# Altium schematic sheet Center Console - IO Expander.SchDoc: Center Console IO Expander
size Letter; Organization: Midnight Sun Solar Rayce Car Team; Address1: University of Waterloo; Address2: 200 University Ave W; Address3: Waterloo, ON, Canada; Address4: N2L 3E9; SheetNumber: 1; SheetTotal: 2; Website: www.uwmidsun.com
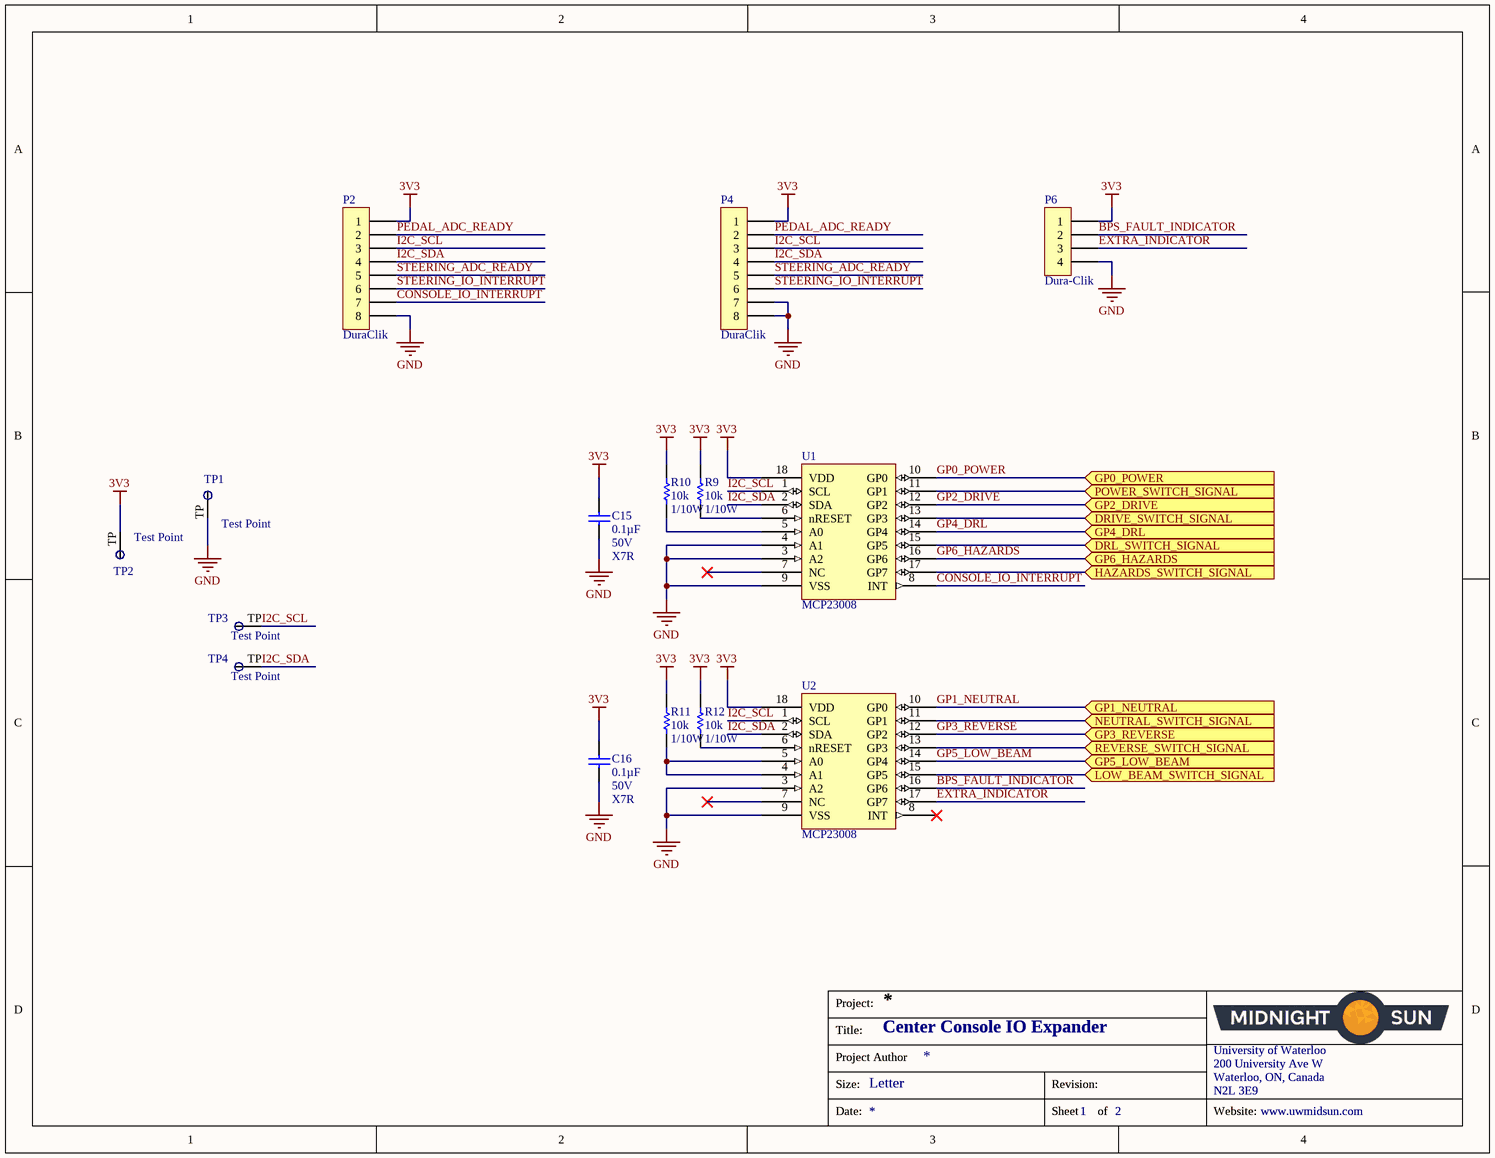
[diagram p0: Center Console - IO Expander.SchDoc]

## Parts
C15  Capacitance: 0.1µF  Voltage: 50V  Temperature Coefficient: X7R  [CAP, 0603]  (hidden comment: CAP CER 0.1UF 50V 10% X7R 0603)
C16  Capacitance: 0.1µF  Voltage: 50V  Temperature Coefficient: X7R  [CAP, 0603]  (hidden comment: CAP CER 0.1UF 50V 10% X7R 0603)
P2  Series: DuraClik  [CONN, 8POS Dura-Clik]  (hidden comment: CONN 8POS DURA-CLIK 0.079")
P4  Series: DuraClik  [CONN, 8POS Dura-Clik]  (hidden comment: CONN 8POS DURA-CLIK 0.079")
P6  Dura-Clik  [CONN, 4POS DURA-CLIK VERT]
R9  Resistance: 10k  Power: 1/10W  [RES, 0603]  (hidden comment: RES 10K OHM 1% 1/10W 0603)
R10  Resistance: 10k  Power: 1/10W  [RES, 0603]  (hidden comment: RES 10K OHM 1% 1/10W 0603)
R11  Resistance: 10k  Power: 1/10W  [RES, 0603]  (hidden comment: RES 10K OHM 1% 1/10W 0603)
R12  Resistance: 10k  Power: 1/10W  [RES, 0603]  (hidden comment: RES 10K OHM 1% 1/10W 0603)
TP1  Test Point  [Test Point]  (no BOM)
TP2  Test Point  [Test Point]  (no BOM)
TP3  Test Point  [Test Point]  (no BOM)
TP4  Test Point  [Test Point]  (no BOM)
U1  MCP23008  [IC 18SOIC]
U2  MCP23008  [IC 18SOIC]

## Ports
DRIVE_SWITCH_SIGNAL (in), DRL_SWITCH_SIGNAL (in), GP0_POWER (in), GP1_NEUTRAL (in), GP2_DRIVE (in), GP3_REVERSE (in), GP4_DRL (in), GP5_LOW_BEAM (in), GP6_HAZARDS (in), HAZARDS_SWITCH_SIGNAL (in), LOW_BEAM_SWITCH_SIGNAL (in), NEUTRAL_SWITCH_SIGNAL (in), POWER_SWITCH_SIGNAL (in), REVERSE_SWITCH_SIGNAL (in)

## Nets
3V3: C15.1 C16.1 P2.1 P4.1 P6.1 R9.1 R10.1 R11.1 R12.1 TP2.TP U1.18(VDD) U2.18(VDD)
GND: C15.2 C16.2 P2.8 P4.7 P4.8 P6.4 TP1.TP U1.3(A2) U1.4(A1) U1.9(VSS) U2.3(A2) U2.9(VSS)
BPS_FAULT_INDICATOR: P6.2 U2.16(GP6)
CONSOLE_IO_INTERRUPT: P2.7 U1.8(INT)
DRIVE_SWITCH_SIGNAL: U1.13(GP3) ; port DRIVE_SWITCH_SIGNAL
DRL_SWITCH_SIGNAL: U1.15(GP5) ; port DRL_SWITCH_SIGNAL
EXTRA_INDICATOR: P6.3 U2.17(GP7)
GP0_POWER: U1.10(GP0) ; port GP0_POWER
GP1_NEUTRAL: U2.10(GP0) ; port GP1_NEUTRAL
GP2_DRIVE: U1.12(GP2) ; port GP2_DRIVE
GP3_REVERSE: U2.12(GP2) ; port GP3_REVERSE
GP4_DRL: U1.14(GP4) ; port GP4_DRL
GP5_LOW_BEAM: U2.14(GP4) ; port GP5_LOW_BEAM
GP6_HAZARDS: U1.16(GP6) ; port GP6_HAZARDS
HAZARDS_SWITCH_SIGNAL: U1.17(GP7) ; port HAZARDS_SWITCH_SIGNAL
I2C_SCL: P2.3 P4.3 TP3.TP U1.1(SCL) U2.1(SCL)
I2C_SDA: P2.4 P4.4 TP4.TP U1.2(SDA) U2.2(SDA)
LOW_BEAM_SWITCH_SIGNAL: U2.15(GP5) ; port LOW_BEAM_SWITCH_SIGNAL
NEUTRAL_SWITCH_SIGNAL: U2.11(GP1) ; port NEUTRAL_SWITCH_SIGNAL
PEDAL_ADC_READY: P2.2 P4.2
POWER_SWITCH_SIGNAL: U1.11(GP1) ; port POWER_SWITCH_SIGNAL
REVERSE_SWITCH_SIGNAL: U2.13(GP3) ; port REVERSE_SWITCH_SIGNAL
STEERING_ADC_READY: P2.5 P4.5
STEERING_IO_INTERRUPT: P2.6 P4.6
NetR9_2: R9.2 U1.6(nRESET)
NetR10_2: R10.2 U1.5(A0)
NetR11_2: R11.2 U2.4(A1) U2.5(A0)
NetR12_2: R12.2 U2.6(nRESET)

Not connected (* = marked no-connect by the designer): U1 7(NC)*; U2 7(NC)* 8(INT)*

## Notes on the sheet
- Project:
- Title:
- Size:
- Project Author
- Letter
- Revision:
- University of Waterloo
- 200 University Ave W
- Waterloo, ON, Canada
- N2L 3E9
- Date:
- Sheet
- of
- Website:

## Library data of the parts
C15 C16 = CAP CER 0.1UF 50V 10% X7R 0603: 0.10µF ±10% 50V Ceramic Capacitor X7R 0603 (1608 Metric); Manufacturer 1: AVX Corporation; Manufacturer Part Number 1: 06035C104KAT2A; Supplier 1: Digi-Key; Supplier Part Number 1: 478-5052-1-ND; Packaging: Cut Tape (CT); Part Status: Active; Operating Temperature: -55°C ~ 125°C; Ratings: -; Mounting Type: Surface Mount, MLCC; Package / Case: 0603 (1608 Metric); Size / Dimension: 0.063" L x 0.032" W (1.60mm x 0.81mm); Height - Seated (Max): -; Thickness (Max): 0.035" (0.90mm); Lead Spacing: -; Lead Style: -; ComponentLink1URL: http://datasheets.avx.com/X7RDielectric.pdf; ComponentLink1Description: http://datasheets.avx.com/X7RDielectric.pdf; Tolerance: ±10%
P2 P4 = CONN 8POS DURA-CLIK 0.079": 8 Positions Header Connector 0.079" (2.00mm) Surface Mount Tin; Manufacturer 1: Molex, LLC; Manufacturer Part Number 1: 5600200820; Style: Board to Cable/Wire; Shrouding: Shrouded - 4 Wall; Number of Positions: 8; Number of Positions Loaded: All; Mated Stacking Heights: 9.3mm; Supplier 1: Digi-Key; Supplier Part Number 1: WM10868CT-ND; Packaging: Cut Tape (CT); Part Status: Active; Connector Type: Header; Contact Type: Male Pin; Pitch - Mating: 0.079" (2.00mm); Number of Rows: 1; Row Spacing - Mating: -; Mounting Type: Surface Mount; Termination: Solder; Fastening Type: Latch Lock; Contact Length - Mating: -; Contact Length - Post: -; Overall Contact Length: -; Insulation Height: 0.315" (8.00mm); Contact Shape: Square; Contact Finish - Mating: Tin; Contact Finish Thickness - Mating: -; Contact Finish - Post: Tin; Contact Material: Copper Alloy; Insulation Material: Polyamide (PA), Nylon; Operating Temperature: -; Ingress Protection: -; Material Flammability Rating: -; Insulation Color: Natural; Current Rating: -; Contact Finish Thickness - Post: -; ComponentLink1URL: http://www.molex.com/pdm_docs/sd/5600200820_sd.pdf; ComponentLink1Description: http://www.molex.com/pdm_docs/sd/5600200820_sd.pdf; Voltage: -
P6 = CONN 4POS DURA-CLIK 0.079": 4 Positions Header Connector 0.079" (2.00mm) Surface Mount Tin; Manufacturer: Molex, LLC; Manufacturer Part Number: 5600200420; Style: Board to Cable/Wire; Shrouding: Shrouded - 4 Wall; Number of Positions: 4; Number of Positions Loaded: All; Mated Stacking Heights: 9.3mm; Supplier 1: Digi-Key; RoHS: RoHS Compliant; Category: Connectors, Interconnects; Stock 1: 9367; Pricing 1: 1=2.23, 10=2.022, 25=1.898, 50=1.8156, 100=1.733 (CAD); Packaging: Cut Tape (CT); Part Status: Active; Connector Type: Header; Contact Type: Male Pin; Pitch - Mating: 0.079" (2.00mm); Number of Rows: 1; Row Spacing - Mating: -; Mounting Type: Surface Mount; Termination: Solder; Fastening Type: Latch Lock; Contact Length - Mating: -; Contact Length - Post: -; Overall Contact Length: -; Insulation Height: 0.315" (8.00mm); Contact Shape: Square; Contact Finish - Mating: Tin; Contact Finish Thickness - Mating: -; Contact Finish - Post: Tin; Contact Material: Copper Alloy; Insulation Material: Polyamide (PA), Nylon; Features: Solder Retention; Operating Temperature: -; Ingress Protection: -; Material Flammability Rating: -; Insulation Color: Natural; Current Rating: -; Voltage Rating: -; Contact Finish Thickness - Post: -; Applications: Automotive, Industrial; ComponentLink1URL: http://www.molex.com/pdm_docs/sd/5600200420_sd.pdf; ComponentLink1Description: http://www.molex.com/pdm_docs/sd/5600200420_sd.pdf; Supplier Part Number 1: WM10864CT-ND
R9-R12 = RES 10K OHM 1% 1/10W 0603: RES SMD 10K OHM 1% 1/10W 0603; Manufacturer 1: Yageo; Manufacturer Part Number 1: RC0603FR-0710KL; Temperature Coefficient: ±100ppm/°C; Supplier 1: Digi-Key; Supplier Part Number 1: 311-10.0KHRCT-ND; Packaging: Cut Tape (CT); Part Status: Active; Composition: Thick Film; Operating Temperature: -55°C ~ 155°C; Package / Case: 0603 (1608 Metric); Supplier Device Package: 0603; Size / Dimension: 0.063" L x 0.031" W (1.60mm x 0.80mm); Height - Seated (Max): 0.022" (0.55mm); Failure Rate: -; ComponentLink1URL: http://www.yageo.com/documents/recent/PYu-RC_Group_51_RoHS_L_7.pdf; ComponentLink1Description: http://www.yageo.com/documents/recent/PYu-RC_Group_51_RoHS_L_7.pdf; Tolerance: ±1%
U1 U2 = IC I/O EXPANDER I2C 8B 18SOIC: MCP23008 I/O Expander 8B+1Int 18P SOIC; Manufacturer: Microchip Technology; Manufacturer Part Number: MCP23008T-E/SO; Number of I/O: 8; Interface: I²C; Interrupt Output: Yes; Output Type: Push-Pull; Current - Output Source/Sink: 25mA; Voltage - Supply: 1.8 V ~ 5.5 V; Supplier 1: Digi-Key; Supplier Part Number 1: MCP23008T-E/SOCT-ND; RoHS: RoHS Compliant; Category: Integrated Circuits (ICs); Stock 1: 5607; Pricing 1: 1=1.62, 25=1.3548, 100=1.2431 (CAD); Packaging: Cut Tape (CT); Part Status: Active; Features: POR; Operating Temperature: -40°C ~ 125°C; Mounting Type: Surface Mount; Package / Case: 18-SOIC (0.295", 7.50mm Width); Supplier Device Package: 18-SOIC; ComponentLink1URL: http://www.microchip.com/mymicrochip/filehandler.aspx?ddocname=en021920; ComponentLink1Description: http://www.microchip.com/mymicrochip/filehandler.aspx?ddocname=en021920